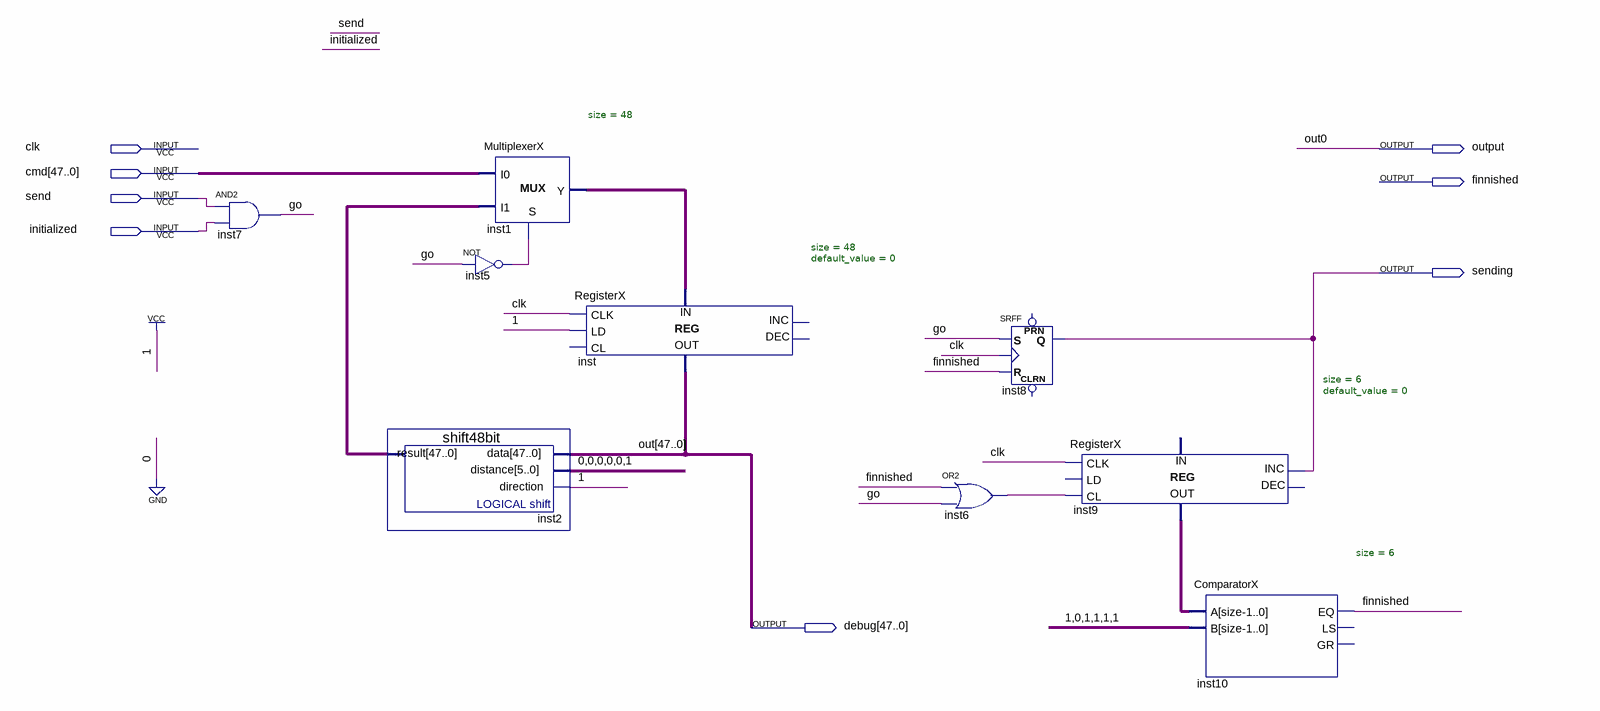
[diagram p0: schematic sheet]
// Quartus schematic sendcmd.bdf as structural Verilog: 9 symbols, 8 pins
module sendcmd (
  input  clk,
  input  [47:0] cmd,
  input  send,
  input  initialized,
  output \output ,
  output finnished,
  output sending,
  output [47:0] debug
);

  wire go, inst5_out, inst6_out;
  wire [5:0] inst9_data_out;
  wire [47:0] inst1_y, inst2_result;

  and inst7 (go, send, initialized);
  shift48bit inst2 (.data(debug), .distance(6'b000001), .direction(1'b1), .result(inst2_result));
  MultiplexerX #(.size(48)) inst1 (.S(inst5_out), .I0(cmd), .I1(inst2_result), .Y(inst1_y));
  not inst5 (inst5_out, go);
  RegisterX #(.size(48), .default_value(0)) inst (
    .CLK(clk), .LD(1'b1), .DATA_IN(inst1_y), .DATA_OUT(debug));  // open: CL, INC, DEC
  or inst6 (inst6_out, finnished, go);
  SRFF inst8 (.S(go), .R(finnished), .CLK(clk), .Q(sending));  // open: PRN, CLRN
  RegisterX #(.size(6), .default_value(0)) inst9 (
    .CLK(clk), .CL(inst6_out), .INC(sending), .DATA_OUT(inst9_data_out));  // open: LD, DEC, DATA_IN
  ComparatorX #(.size(6)) inst10 (.A(inst9_data_out), .B(6'b101111), .EQ(finnished));  // open: LS, GR

  assign \output  = debug[0];

  // Other names for the same wires on the sheet: out[47:0] = debug; out0 = debug[0]
endmodule
